# EasyEDA Pro project Zhurong_高低温功耗测试转接板.eprj

# Schematic Schematic1
Create Date: 2023-06-25; Page Name: P1; Project Name: Zhurong_高低温功耗测试转接板; Schematic Name: Schematic1; Update Date: 2023-06-26; Company: 嘉立创EDA; Page Size: A4; Version: V1.0
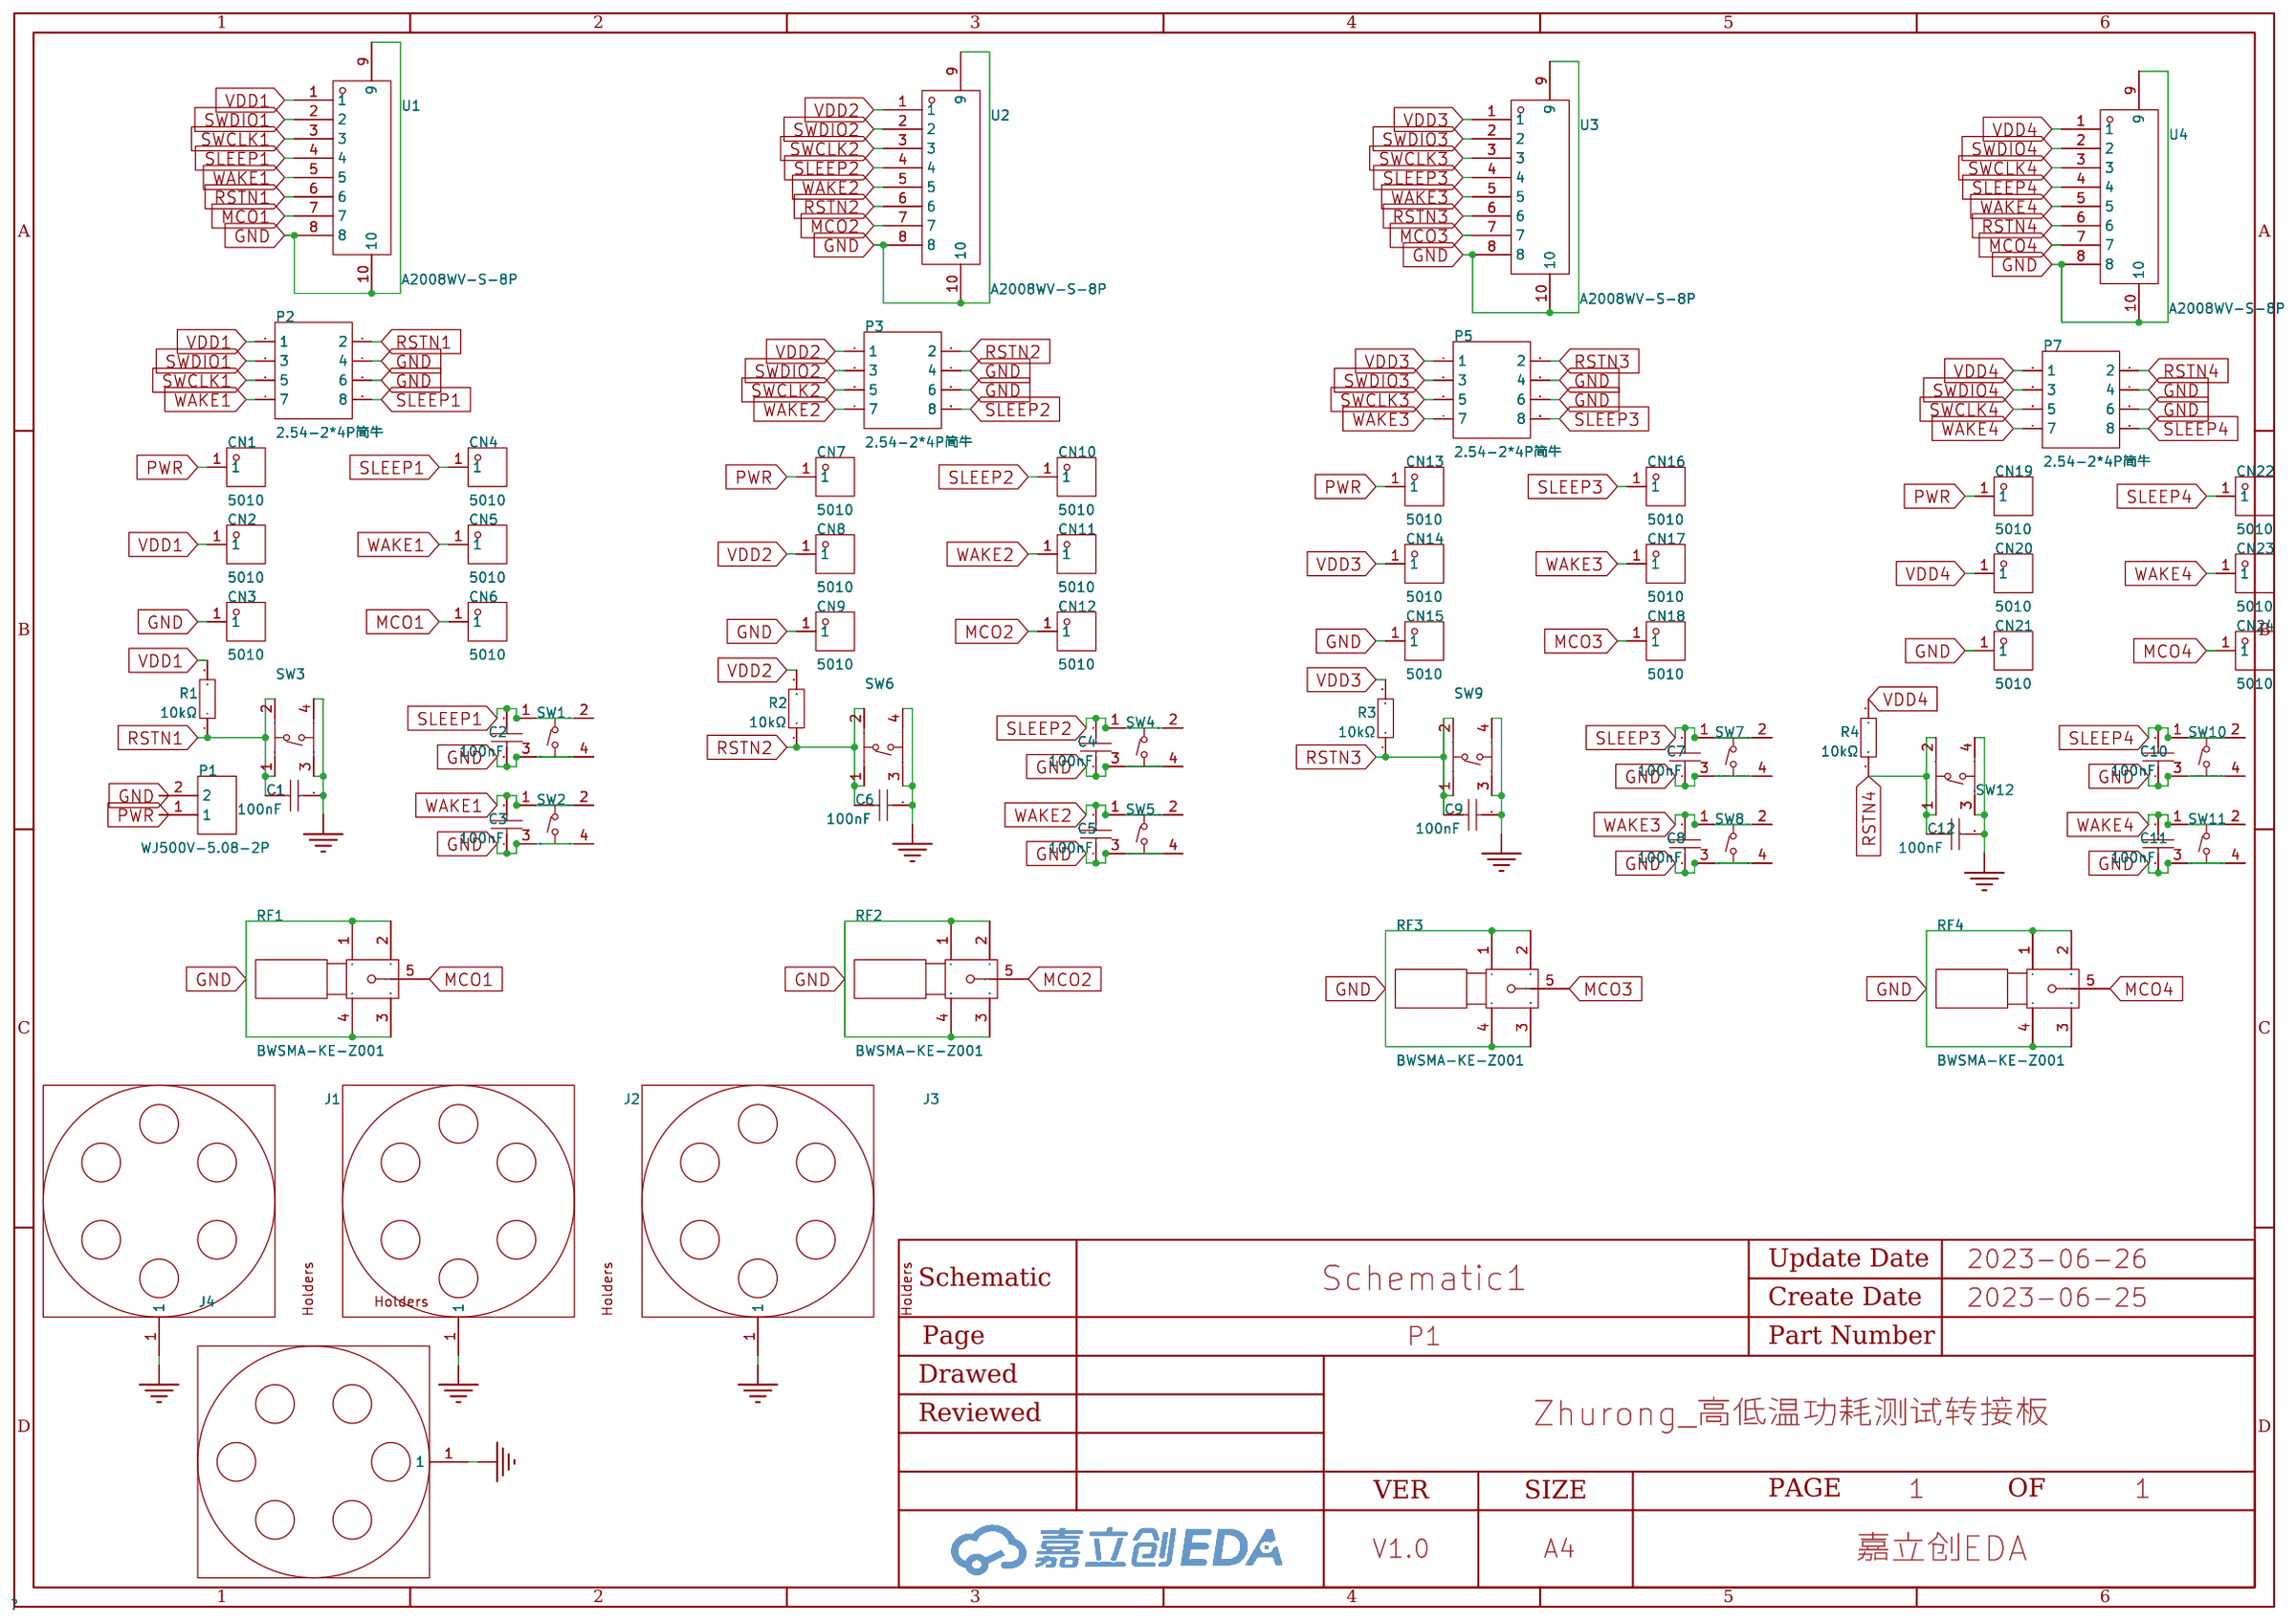
[diagram p0: schematic sheet]

## Parts
C1  100nF  [C0603]
C2  100nF  [C0603]
C3  100nF  [C0603]
C4  100nF  [C0603]
C5  100nF  [C0603]
C6  100nF  [C0603]
C7  100nF  [C0603]
C8  100nF  [C0603]
C9  100nF  [C0603]
C10  100nF  [C0603]
C11  100nF  [C0603]
C12  100nF  [C0603]
CN1  5010  [TESTPOINT-TH_BD3.2]
CN2  5010  [TESTPOINT-TH_BD3.2]
CN3  5010  [TESTPOINT-TH_BD3.2]
CN4  5010  [TESTPOINT-TH_BD3.2]
CN5  5010  [TESTPOINT-TH_BD3.2]
CN6  5010  [TESTPOINT-TH_BD3.2]
CN7  5010  [TESTPOINT-TH_BD3.2]
CN8  5010  [TESTPOINT-TH_BD3.2]
CN9  5010  [TESTPOINT-TH_BD3.2]
CN10  5010  [TESTPOINT-TH_BD3.2]
CN11  5010  [TESTPOINT-TH_BD3.2]
CN12  5010  [TESTPOINT-TH_BD3.2]
CN13  5010  [TESTPOINT-TH_BD3.2]
CN14  5010  [TESTPOINT-TH_BD3.2]
CN15  5010  [TESTPOINT-TH_BD3.2]
CN16  5010  [TESTPOINT-TH_BD3.2]
CN17  5010  [TESTPOINT-TH_BD3.2]
CN18  5010  [TESTPOINT-TH_BD3.2]
CN19  5010  [TESTPOINT-TH_BD3.2]
CN20  5010  [TESTPOINT-TH_BD3.2]
CN21  5010  [TESTPOINT-TH_BD3.2]
CN22  5010  [TESTPOINT-TH_BD3.2]
CN23  5010  [TESTPOINT-TH_BD3.2]
CN24  5010  [TESTPOINT-TH_BD3.2]
J1  -  [DEMO板安装孔]
J2  -  [DEMO板安装孔]
J3  -  [DEMO板安装孔]
J4  -  [DEMO板安装孔]
P1  WJ500V-5.08-2P  [CONN-TH_2P-P5.00_WJ500V-5.08-2P]
P2  2.54-2*4P简牛  [IDC-TH_8P-P2.54-V-R2-C4-S2.54]
P3  2.54-2*4P简牛  [IDC-TH_8P-P2.54-V-R2-C4-S2.54]
P5  2.54-2*4P简牛  [IDC-TH_8P-P2.54-V-R2-C4-S2.54]
P7  2.54-2*4P简牛  [IDC-TH_8P-P2.54-V-R2-C4-S2.54]
R1  10kΩ  [R0805]
R2  10kΩ  [R0805]
R3  10kΩ  [R0805]
R4  10kΩ  [R0805]
RF1  BWSMA-KE-Z001  [SMA-TH_BWSMA-KE-Z001]
RF2  BWSMA-KE-Z001  [SMA-TH_BWSMA-KE-Z001]
RF3  BWSMA-KE-Z001  [SMA-TH_BWSMA-KE-Z001]
RF4  BWSMA-KE-Z001  [SMA-TH_BWSMA-KE-Z001]
SW1  YTS-C015-2K  [SW-SMD_4P-L4.5-W4.5-P3.00-LS6.8]
SW2  YTS-C015-2K  [SW-SMD_4P-L4.5-W4.5-P3.00-LS6.8]
SW3  YTS-C015-2K  [SW-SMD_4P-L4.5-W4.5-P3.00-LS6.8]
SW4  YTS-C015-2K  [SW-SMD_4P-L4.5-W4.5-P3.00-LS6.8]
SW5  YTS-C015-2K  [SW-SMD_4P-L4.5-W4.5-P3.00-LS6.8]
SW6  YTS-C015-2K  [SW-SMD_4P-L4.5-W4.5-P3.00-LS6.8]
SW7  YTS-C015-2K  [SW-SMD_4P-L4.5-W4.5-P3.00-LS6.8]
SW8  YTS-C015-2K  [SW-SMD_4P-L4.5-W4.5-P3.00-LS6.8]
SW9  YTS-C015-2K  [SW-SMD_4P-L4.5-W4.5-P3.00-LS6.8]
SW10  YTS-C015-2K  [SW-SMD_4P-L4.5-W4.5-P3.00-LS6.8]
SW11  YTS-C015-2K  [SW-SMD_4P-L4.5-W4.5-P3.00-LS6.8]
SW12  YTS-C015-2K  [SW-SMD_4P-L4.5-W4.5-P3.00-LS6.8]
U1  A2008WV-S-8P  [CONN-SMD_A2008WV-S-8P]
U2  A2008WV-S-8P  [CONN-SMD_A2008WV-S-8P]
U3  A2008WV-S-8P  [CONN-SMD_A2008WV-S-8P]
U4  A2008WV-S-8P  [CONN-SMD_A2008WV-S-8P]

## Library data of the parts
C1-C12 = 0603B104K500NT: 容值:100nF;精度:±10%;额定电压:50V;材质(温度系数):X7R;; LCSC Part Name: 100nF ±10% 50V; Supplier Part: C30926; Manufacturer: FH(风华); Supplier Footprint: 0603; JLCPCB Part Class: Extended Part; Datasheet: https://atta.szlcsc.com/upload/public/pdf/source/20170923/C30926_1506149436298988724.pdf; Supplier: LCSC; Tolerance: ±10%; Voltage Rated: 50V; Temperature Coefficient: X7R
CN1-CN24 = 5010_C2906765: LCSC Part Name: 测试点; Supplier Part: C2906765; Manufacturer: Keystone; JLCPCB Part Class: Extended Part; Datasheet: https://atta.szlcsc.com/upload/public/pdf/source/20211102/FE81CF4D2CA40A78538BB94A7617104F.pdf; Supplier: LCSC
J1-J4 = 螺孔_3.1X6MM
P1 = WJ500V-5.08-2P: 间距:5.08mm;结构:1x2P;排数:1;每排PIN数:2;安装方式:直针;额定电流:18A;额定电压:250V;线规 - AWG:14~30;线规 - mm2:2.5;工作温度范围:-40℃~+105℃;颜色:绿色;; LCSC Part Name: 5.08mm 1x2P 排数:1 每排P数:2 直针 可拼接; Supplier Part: C8465; Manufacturer: KANGNEX(康奈克斯电气); Supplier Footprint: 插件,P=5.08mm; JLCPCB Part Class: Extended Part; Datasheet: https://atta.szlcsc.com/upload/public/pdf/source/20191225/C8465_02D34CE5B5B4A53DF5891601D97FA9F4.pdf; Supplier: LCSC; Pitch: 5.08mm; Structure: 1x2P; Number of Rows: 1; Number of PINs Per Row: 2; Mounting Style: 直针; Current Rating (Max): 18A; Voltage Rating (Max): 250V; Wire Gauge - AWG: 14~30; Wire Gauge - mm2: 2.5; Operating Temperature Range: -40℃~+105℃; Color: 绿色
P2 P3 P5 P7 = 2.54-2*4P简牛: 连接器类型:简牛座;每排PIN数:4;结构:2x4P;排数:2;间距:2.54mm;行距:2.54mm;封装形式:直插;触头材质:-;触头镀层:-;; LCSC Part Name: 每排P数:4 2x4P 排数:2 2.54mm; Supplier Part: C9135; Manufacturer: BOOMELE(博穆精密); Supplier Footprint: 插件,P=2.54mm; JLCPCB Part Class: Extended Part; Datasheet: https://atta.szlcsc.com/upload/public/pdf/source/20131122/1457706661290.pdf; Supplier: LCSC; Connector Type: 简牛座; Pin Number in each Row: 4; Structure: 2x4P; Number of Rows: 2; Pitch: 2.54mm; Row Spacing: 2.54mm; Holder Type: 直插
R1-R4 = RC0805FR-0710KL: 阻值:10kΩ;精度:±1%;功率:125mW;温度系数:±100ppm/℃;最大工作电压:150V;工作温度范围:-55℃~+155℃;; LCSC Part Name: 10kΩ ±1% 125mW; Supplier Part: C84376; Manufacturer: YAGEO(国巨); Supplier Footprint: 0805; JLCPCB Part Class: Extended Part; Datasheet: https://atta.szlcsc.com/upload/public/pdf/source/20170412/1491969112878.pdf; Supplier: LCSC; Tolerance: ±1%; Power(Watts): 125mW; Temperature Coefficient: ±100ppm/℃; Overload Voltage (Max): 150V; Operating Temperature Range: -55℃~+155℃
RF1-RF4 = BWSMA-KE-Z001_C496549: 连接器类型:板端;射频系列:SMA;接口类型:内孔;端口数量:1;阻抗:50Ω;频率-最大值:12.4GHz;样式:正脚;接口直径:-;接口长度/高度:-;工作温度范围:-65℃~+165℃;; LCSC Part Name: SMA 内孔 正脚 SMA直头正脚板端座子; Supplier Part: C496549; Manufacturer: BAT WIRELESS(蝙蝠无线); Supplier Footprint: 插件; JLCPCB Part Class: Extended Part; Datasheet: https://atta.szlcsc.com/upload/public/pdf/source/20200416/C496549_767995352B6C9E98F20D658FDC70347F.pdf; Supplier: LCSC; Connector Type: 板端; RF Series: SMA; Interface Type: 内孔; Number of Ports: 1; Impedance: 50Ω; Frequency-Max: 12.4GHz; Style: 正脚; Operating Temperature Range: -65℃~+165℃
SW1-SW12 = YTS-C015-2K: 触点电流:50mA;额定电压(DC):12V;绝缘电阻:100MΩ;电路结构:单刀单掷;安装方式:立贴;作用力:260gf@±50gf;机械寿命:5万次;带支架:否;; LCSC Part Name: 4.5*4.5*9mm 立贴 轻触开关; Supplier Part: C2910853; Manufacturer: YIYUAN(怡远); Supplier Footprint: SMD; JLCPCB Part Class: Extended Part; Datasheet: https://atta.szlcsc.com/upload/public/pdf/source/20211108/F9693C0D937C44F164226CF82C756AB9.pdf; Supplier: LCSC; Contact Current: 50mA; Voltage Rating (DC): 12V; Insulation Resistance: 100MΩ; Circuit: 单刀单掷; Mounting Style: 立贴; Actuator Style: 圆形按钮; Actuator/Cap Color: 黑色; Operating Force: 260gf@±50gf; Mechanical Life: 5万次; Pin Style: 鸥翼型; Switch Length: 4.5mm; Switch Width: 4.5mm; Switch Height: 9mm; Strike Gundam: 否
U1-U4 = A2008WV-S-8P: 参考系列:PH;间距:2mm;插针结构:1x8P;排数:1;每排PIN数:8;行距:-;安装方式:-;触头材质:黄铜;; LCSC Part Name: PH 2mm 1x8P 镀锡; Supplier Part: C273128; Manufacturer: CJT(长江连接器); Supplier Footprint: SMD,P=2mm; JLCPCB Part Class: Extended Part; Datasheet: https://atta.szlcsc.com/upload/public/pdf/source/20180913/C273128_BB1852F7672CD820F7AD4E26555E7BEC.pdf; Supplier: LCSC; Reference Series: PH; Pitch: 2mm; Pins Structure: 1x8P; Number of Rows: 1; Number of PINs Per Row: 8; Contact Material: 黄铜

## Nets
GND: C1.2 C2.1 C3.1 C4.1 C5.1 C6.2 C7.1 C8.1 C9.2 C10.1 C11.1 C12.2 CN3.1 CN9.1 CN15.1 CN21.1 J1.1 J2.1 J3.1 J4.1 P1.2 P2.4 P2.6 P3.4 P3.6 P5.4 P5.6 P7.4 P7.6 RF1.1 RF1.2 RF1.3 RF1.4 RF2.1 RF2.2 RF2.3 RF2.4 RF3.1 RF3.2 RF3.3 RF3.4 RF4.1 RF4.2 RF4.3 RF4.4 SW1.3 SW1.4 SW2.3 SW2.4 SW3.3 SW3.4 SW4.3 SW4.4 SW5.3 SW5.4 SW6.3 SW6.4 SW7.3 SW7.4 SW8.3 SW8.4 SW9.3 SW9.4 SW10.3 SW10.4 SW11.3 SW11.4 SW12.3 SW12.4 U1.8 U1.9 U1.10 U2.8 U2.9 U2.10 U3.8 U3.9 U3.10 U4.8 U4.9 U4.10
VDD1: CN2.1 P2.1 R1.2 U1.1
VDD2: CN8.1 P3.1 R2.2 U2.1
VDD3: CN14.1 P5.1 R3.2 U3.1
VDD4: CN20.1 P7.1 R4.2 U4.1
MCO1: CN6.1 RF1.5 U1.7
MCO2: CN12.1 RF2.5 U2.7
MCO3: CN18.1 RF3.5 U3.7
MCO4: CN24.1 RF4.5 U4.7
PWR: CN1.1 CN7.1 CN13.1 CN19.1 P1.1
RSTN1: C1.1 P2.2 R1.1 SW3.1 SW3.2 U1.6
RSTN2: C6.1 P3.2 R2.1 SW6.1 SW6.2 U2.6
RSTN3: C9.1 P5.2 R3.1 SW9.1 SW9.2 U3.6
RSTN4: C12.1 P7.2 R4.1 SW12.1 SW12.2 U4.6
SLEEP1: C2.2 CN4.1 P2.8 SW1.1 SW1.2 U1.4
SLEEP2: C4.2 CN10.1 P3.8 SW4.1 SW4.2 U2.4
SLEEP3: C7.2 CN16.1 P5.8 SW7.1 SW7.2 U3.4
SLEEP4: C10.2 CN22.1 P7.8 SW10.1 SW10.2 U4.4
SWCLK1: P2.5 U1.3
SWCLK2: P3.5 U2.3
SWCLK3: P5.5 U3.3
SWCLK4: P7.5 U4.3
SWDIO1: P2.3 U1.2
SWDIO2: P3.3 U2.2
SWDIO3: P5.3 U3.2
SWDIO4: P7.3 U4.2
WAKE1: C3.2 CN5.1 P2.7 SW2.1 SW2.2 U1.5
WAKE2: C5.2 CN11.1 P3.7 SW5.1 SW5.2 U2.5
WAKE3: C8.2 CN17.1 P5.7 SW8.1 SW8.2 U3.5
WAKE4: C11.2 CN23.1 P7.7 SW11.1 SW11.2 U4.5

# Board PCB1
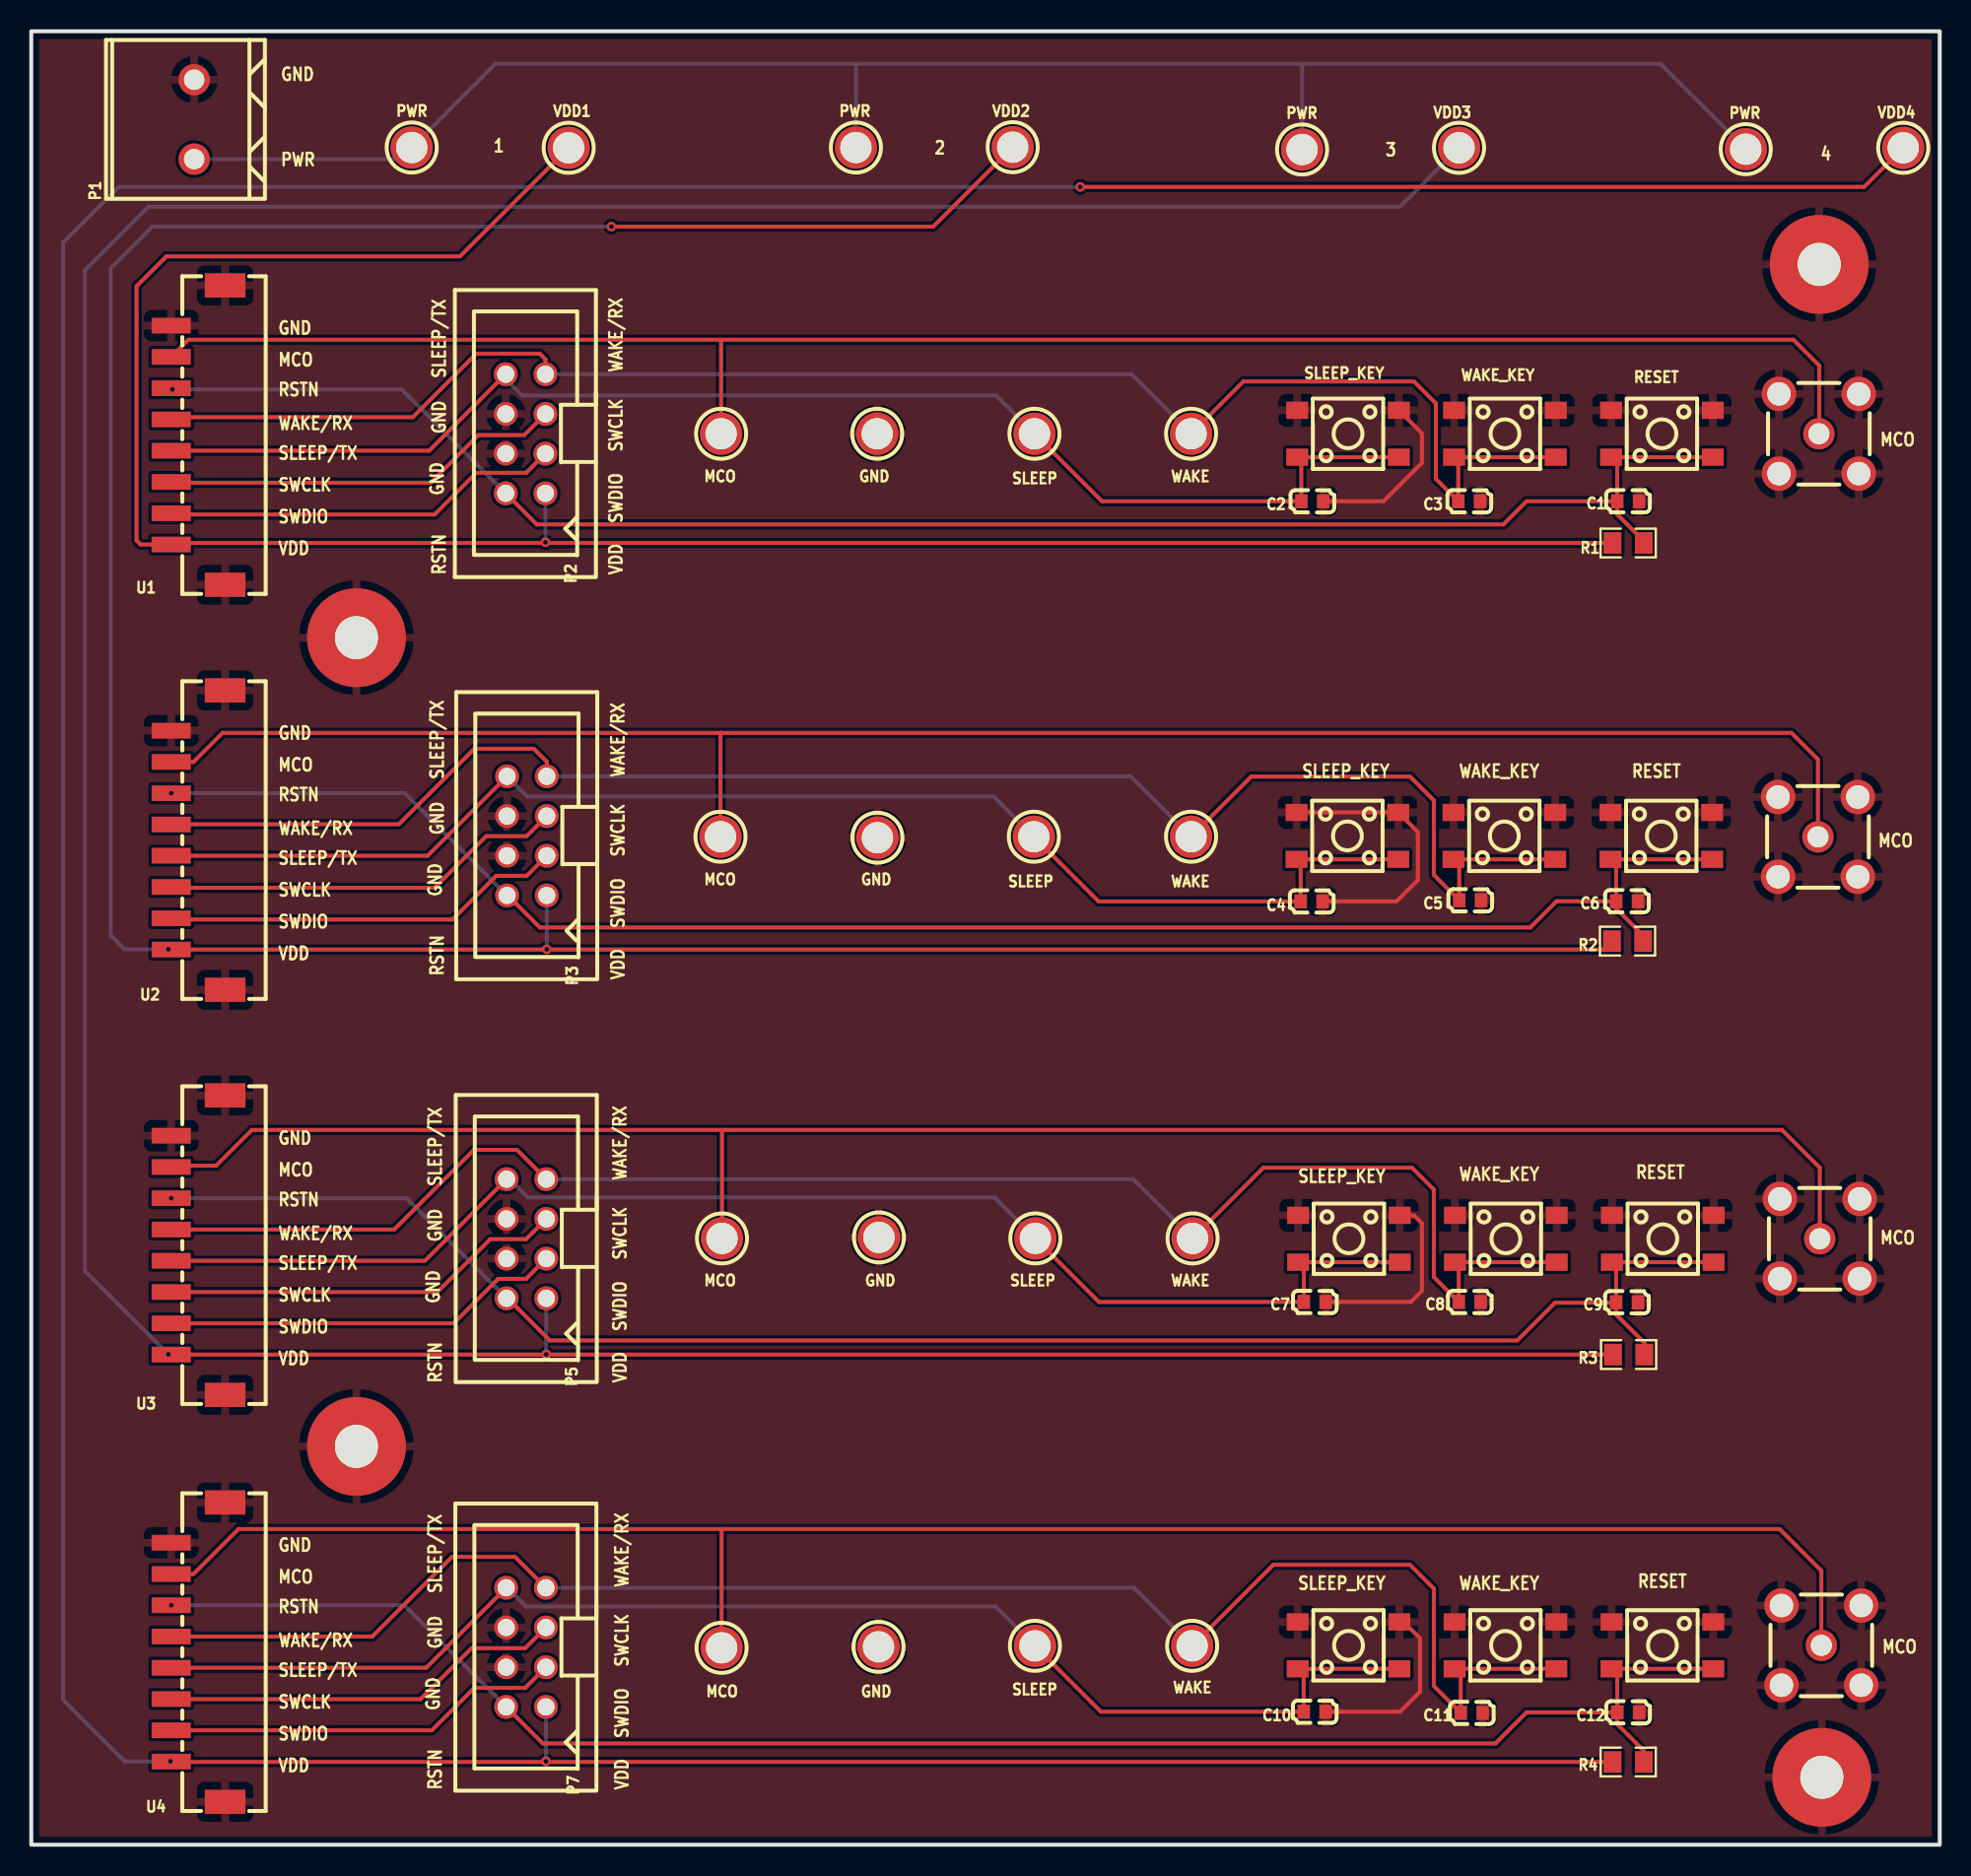
[diagram p1: board, top side]
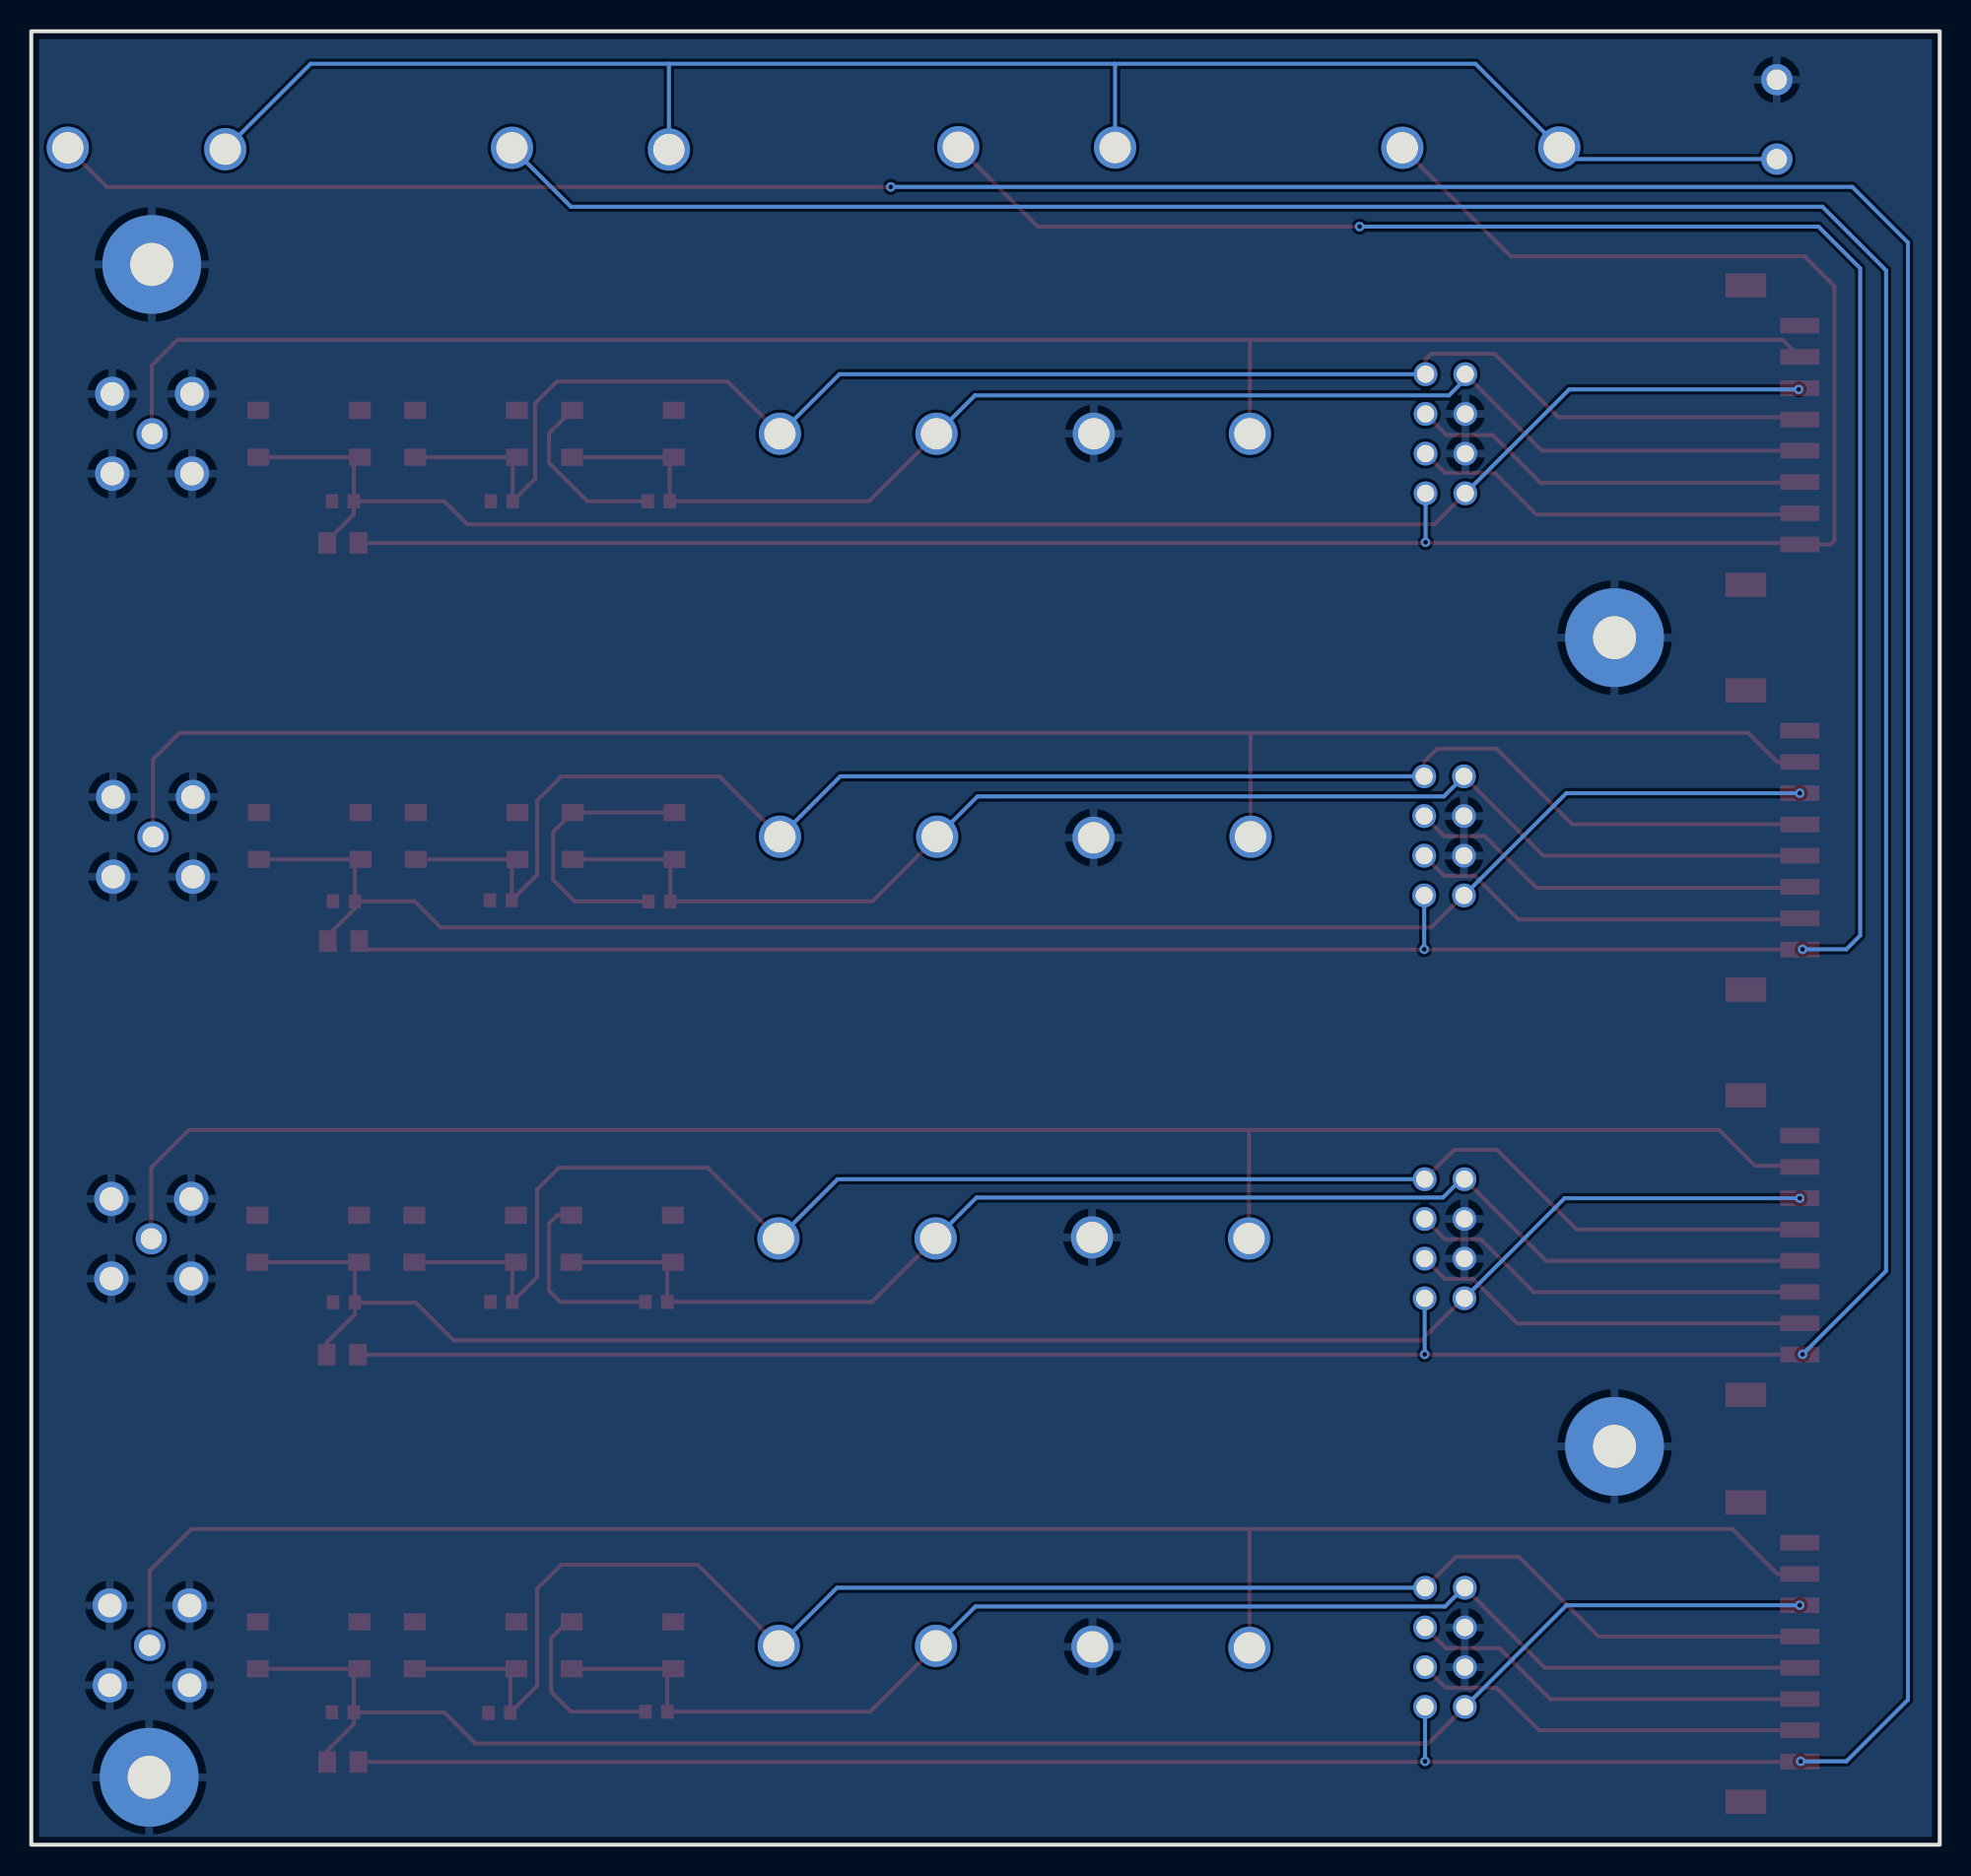
[diagram p2: board, bottom side, seen from below]

Outline 122 x 116 mm; copper layers: Top Layer, Bottom Layer. Coordinates in mm from the lower left corner of the outline.
Outline path: rectangle 0,116 122,0
Stack: Top Layer 0.035mm / Dielectric1 1.51mm FR4 er 4.5 / Bottom Layer 0.035mm

## Design rules (mm)
template: 自定义配置
spacing copperThickness1oz (default): track to track 0.102, other pairs 0.152 to 0.3
spacing copperThickness2oz: track to track 0.203, other pairs 0.152 to 0.3
track width copperThickness1oz (default): min 0.127, default 0.254, max 2.54
track width copperThickness2oz: min 0.203, default 0.254, max 2.54
differential pair differentialPair (default): width min 0.127, default 0.254, max 2.54; gap min 0.152, default 0.152
via viaSize (default): diameter min 0.5, default 0.61, max 10; hole min 0.3, default 0.305, max 6.3

## Placement (name value [footprint] x y rotation side)
C1  100nF  [C0603]  102.08 85.94 0 top
C2  100nF  [C0603]  81.89 85.94 180 top
C3  100nF  [C0603]  91.92 85.94 180 top
C4  100nF  [C0603]  81.85 60.34 180 top
C5  100nF  [C0603]  91.98 60.41 180 top
C6  100nF  [C0603]  102.02 60.35 0 top
C7  100nF  [C0603]  82.05 34.72 180 top
C8  100nF  [C0603]  91.95 34.72 180 top
C9  100nF  [C0603]  102.01 34.7 0 top
C10  100nF  [C0603]  82.04 8.51 180 top
C11  100nF  [C0603]  92.08 8.44 180 top
C12  100nF  [C0603]  102.09 8.47 0 top
GND  -  [TESTPOINT-TH_BD3.2]  54.08 90.25 90 top
GND#2  -  [TESTPOINT-TH_BD3.2]  54.09 64.42 90 top
GND#3  -  [TESTPOINT-TH_BD3.2]  54.19 38.85 90 top
GND#4  -  [TESTPOINT-TH_BD3.2]  54.16 12.66 90 top
J1  -  [demo板安装孔]  20.79 77.21 0 top
J2  -  [demo板安装孔]  114.3 101.09 0 top
J3  -  [demo板安装孔]  114.46 4.31 0 top
J4  -  [demo板安装孔]  20.79 25.48 0 top
MCO  -  [TESTPOINT-TH_BD3.2]  44.1 90.25 90 top
MCO#2  -  [TESTPOINT-TH_BD3.2]  44.06 64.48 90 top
MCO#3  -  [TESTPOINT-TH_BD3.2]  44.16 38.78 90 top
MCO#4  -  [TESTPOINT-TH_BD3.2]  44.13 12.6 90 top
P1  WJ500V-5.08-2P  [CONN-TH_2P-P5.00_WJ500V-5.08-2P]  10.41 110.36 90 top
P2  2.54-2*4P简牛  [IDC-TH_8P-P2.54-V-R2-C4-S2.54]  31.6 90.25 90 top
P3  2.54-2*4P简牛  [IDC-TH_8P-P2.54-V-R2-C4-S2.54]  31.68 64.53 90 top
P5  2.54-2*4P简牛  [IDC-TH_8P-P2.54-V-R2-C4-S2.54]  31.65 38.76 90 top
P7  2.54-2*4P简牛  [IDC-TH_8P-P2.54-V-R2-C4-S2.54]  31.63 12.63 90 top
PWR  -  [TESTPOINT-TH_BD3.2]  24.32 108.56 0 top
PWR#2  -  [TESTPOINT-TH_BD3.2]  52.72 108.56 0 top
PWR#3  -  [TESTPOINT-TH_BD3.2]  81.24 108.44 0 top
PWR#4  -  [TESTPOINT-TH_BD3.2]  109.6 108.46 0 top
R1  10kΩ  [R0805]  102.08 83.27 180 top
R2  10kΩ  [R0805]  102.04 57.8 180 top
R3  10kΩ  [R0805]  102.11 31.35 180 top
R4  10kΩ  [R0805]  102.09 5.29 180 top
RESET  YTS-C015-2K  [SW-SMD_4P-L4.5-W4.5-P3.00-LS6.8]  104.24 90.25 180 top
RF1  BWSMA-KE-Z001  [SMA-TH_BWSMA-KE-Z001]  114.27 90.25 90 top
RF2  BWSMA-KE-Z001  [SMA-TH_BWSMA-KE-Z001]  114.22 64.47 90 top
RF3  BWSMA-KE-Z001  [SMA-TH_BWSMA-KE-Z001]  114.33 38.76 90 top
RF4  BWSMA-KE-Z001  [SMA-TH_BWSMA-KE-Z001]  114.43 12.75 90 top
SLEEP  -  [TESTPOINT-TH_BD3.2]  64.13 90.25 90 top
SLEEP#2  -  [TESTPOINT-TH_BD3.2]  64.09 64.48 90 top
SLEEP#3  -  [TESTPOINT-TH_BD3.2]  64.19 38.78 90 top
SLEEP#4  -  [TESTPOINT-TH_BD3.2]  64.16 12.72 90 top
SLEEP_KEY  YTS-C015-2K  [SW-SMD_4P-L4.5-W4.5-P3.00-LS6.8]  84.18 90.25 180 top
SW4  YTS-C015-2K  [SW-SMD_4P-L4.5-W4.5-P3.00-LS6.8]  84.13 64.53 180 top
SW5  YTS-C015-2K  [SW-SMD_4P-L4.5-W4.5-P3.00-LS6.8]  94.17 64.53 180 top
SW6  YTS-C015-2K  [SW-SMD_4P-L4.5-W4.5-P3.00-LS6.8]  104.2 64.53 180 top
SW7  YTS-C015-2K  [SW-SMD_4P-L4.5-W4.5-P3.00-LS6.8]  84.23 38.76 180 top
SW8  YTS-C015-2K  [SW-SMD_4P-L4.5-W4.5-P3.00-LS6.8]  94.27 38.76 180 top
SW9  YTS-C015-2K  [SW-SMD_4P-L4.5-W4.5-P3.00-LS6.8]  104.3 38.76 180 top
SW10  YTS-C015-2K  [SW-SMD_4P-L4.5-W4.5-P3.00-LS6.8]  84.21 12.75 180 top
SW11  YTS-C015-2K  [SW-SMD_4P-L4.5-W4.5-P3.00-LS6.8]  94.24 12.75 180 top
SW12  YTS-C015-2K  [SW-SMD_4P-L4.5-W4.5-P3.00-LS6.8]  104.27 12.75 180 top
U1  A2008WV-S-8P  [CONN-SMD_A2008WV-S-8P]  10.67 90.17 90 top
U2  A2008WV-S-8P  [CONN-SMD_A2008WV-S-8P]  10.67 64.26 90 top
U3  A2008WV-S-8P  [CONN-SMD_A2008WV-S-8P]  10.67 38.35 90 top
U4  A2008WV-S-8P  [CONN-SMD_A2008WV-S-8P]  10.67 12.32 90 top
VDD1  5010  [TESTPOINT-TH_BD3.2]  34.35 108.55 0 top
VDD2  5010  [TESTPOINT-TH_BD3.2]  62.74 108.59 0 top
VDD3  5010  [TESTPOINT-TH_BD3.2]  91.27 108.55 0 top
VDD4  5010  [TESTPOINT-TH_BD3.2]  119.67 108.55 0 top
WAKE  -  [TESTPOINT-TH_BD3.2]  74.14 90.25 90 top
WAKE#2  -  [TESTPOINT-TH_BD3.2]  74.14 64.48 90 top
WAKE#3  -  [TESTPOINT-TH_BD3.2]  74.24 38.78 90 top
WAKE#4  -  [TESTPOINT-TH_BD3.2]  74.21 12.72 90 top
WAKE_KEY  YTS-C015-2K  [SW-SMD_4P-L4.5-W4.5-P3.00-LS6.8]  94.21 90.25 180 top

## Footprints (pads in the part's own frame, mm; a bottom-side part is the same pattern mirrored in y, then rotated)
C0603
  rect 0.8x0.9 smd: 1(-0.7,0) 2(0.7,0)
CONN-SMD_A2008WV-S-8P
  rect 1x2.5 smd: 1(-7,1.724) 2(-5,1.724) 3(-3,1.724) 4(-1,1.724) 5(1,1.724) 6(2.999,1.724) 7(5,1.724) 8(7,1.724)
  rect 1.55x2.6 smd: 9(-9.575,-1.724) 10(9.575,-1.724)
CONN-TH_2P-P5.00_WJ500V-5.08-2P
  round 2 hole 1.3: 1(-2.54,0) 2(2.54,0)
demo板安装孔
  round 6.32 hole 2.75: 1(0,0)
IDC-TH_8P-P2.54-V-R2-C4-S2.54
  round 1.524 hole 1.1: 1(-3.81,-1.27) 2(-3.81,1.27) 3(-1.27,-1.27) 4(-1.27,1.27) 5(1.27,-1.27) 6(1.27,1.27) 7(3.81,-1.27) 8(3.81,1.27)
R0805
  rect 1.133x1.377 smd: 1(-1,0) 2(1,0)
SMA-TH_BWSMA-KE-Z001
  round 2.2 hole 1.5: 1(-2.55,-2.55) 2(-2.55,2.55) 3(2.55,2.55) 4(2.55,-2.55)
  round 2 hole 1.35: 5(0,0)
SW-SMD_4P-L4.5-W4.5-P3.00-LS6.8
  rect 1.4x1.1 smd: 1(-3.25,1.5) 2(3.25,1.5) 3(-3.25,-1.5) 4(3.25,-1.5)
TESTPOINT-TH_BD3.2
  round 2.7 hole 2: 1(0,0)

## Nets
GND: C1.2 C2.1 C3.1 C4.1 C5.1 C6.2 C7.1 C8.1 C9.2 C10.1 C11.1 C12.2 GND.1 GND#2.1 GND#3.1 GND#4.1 J1.1 J2.1 J3.1 J4.1 P1.2 P2.4 P2.6 P3.4 P3.6 P5.4 P5.6 P7.4 P7.6 RESET.3 RESET.4 RF1.1 RF1.2 RF1.3 RF1.4 RF2.1 RF2.2 RF2.3 RF2.4 RF3.1 RF3.2 RF3.3 RF3.4 RF4.1 RF4.2 RF4.3 RF4.4 SLEEP_KEY.3 SLEEP_KEY.4 SW4.3 SW4.4 SW5.3 SW5.4 SW6.3 SW6.4 SW7.3 SW7.4 SW8.3 SW8.4 SW9.3 SW9.4 SW10.3 SW10.4 SW11.3 SW11.4 SW12.3 SW12.4 U1.8 U1.9 U1.10 U2.8 U2.9 U2.10 U3.8 U3.9 U3.10 U4.8 U4.9 U4.10 WAKE_KEY.3 WAKE_KEY.4
VDD1: P2.1 R1.2 U1.1 VDD1.1
VDD2: P3.1 R2.2 U2.1 VDD2.1
VDD3: P5.1 R3.2 U3.1 VDD3.1
VDD4: P7.1 R4.2 U4.1 VDD4.1
MCO1: MCO.1 RF1.5 U1.7
MCO2: MCO#2.1 RF2.5 U2.7
MCO3: MCO#3.1 RF3.5 U3.7
MCO4: MCO#4.1 RF4.5 U4.7
PWR: P1.1 PWR.1 PWR#2.1 PWR#3.1 PWR#4.1
RSTN1: C1.1 P2.2 R1.1 RESET.1 RESET.2 U1.6
RSTN2: C6.1 P3.2 R2.1 SW6.1 SW6.2 U2.6
RSTN3: C9.1 P5.2 R3.1 SW9.1 SW9.2 U3.6
RSTN4: C12.1 P7.2 R4.1 SW12.1 SW12.2 U4.6
SLEEP1: C2.2 P2.8 SLEEP.1 SLEEP_KEY.1 SLEEP_KEY.2 U1.4
SLEEP2: C4.2 P3.8 SLEEP#2.1 SW4.1 SW4.2 U2.4
SLEEP3: C7.2 P5.8 SLEEP#3.1 SW7.1 SW7.2 U3.4
SLEEP4: C10.2 P7.8 SLEEP#4.1 SW10.1 SW10.2 U4.4
SWCLK1: P2.5 U1.3
SWCLK2: P3.5 U2.3
SWCLK3: P5.5 U3.3
SWCLK4: P7.5 U4.3
SWDIO1: P2.3 U1.2
SWDIO2: P3.3 U2.2
SWDIO3: P5.3 U3.2
SWDIO4: P7.3 U4.2
WAKE1: C3.2 P2.7 U1.5 WAKE.1 WAKE_KEY.1 WAKE_KEY.2
WAKE2: C5.2 P3.7 SW5.1 SW5.2 U2.5 WAKE#2.1
WAKE3: C8.2 P5.7 SW8.1 SW8.2 U3.5 WAKE#3.1
WAKE4: C11.2 P7.7 SW11.1 SW11.2 U4.5 WAKE#4.1

## Via types
v1: diameter 0.61, hole 0.305, Top Layer to Bottom Layer, 14 vias

## Routing (per net, layer and track width the routed paths; a pad name or vN(x,y) marks a point on that pad's centre or on a via; arc(x,y) is an arc through that point)
GND: length 53.4
  Top Layer w0.254: SLEEP_KEY.3 88.9,90.28 88.9,88.39 86.44,85.94 C2.1 ; SW4.4 SW4.3 88.65,64.77 88.65,61.72 87.26,60.34 C4.1 ; C10.1 87.5,8.51 88.77,9.78 88.77,13.21 87.73,14.25 SW10.3 ; SW7.3 88.39,40.26 88.9,39.75 88.9,35.43 88.19,34.72 C7.1
VDD1: length 145.4
  Top Layer w0.254: 32.87,83.27 32.87,83.27 v1(32.87,83.31) ; 32.87,83.27 9.04,83.27 U1.1 6.98,83.17 6.73,83.42 6.73,99.69 8.64,101.6 27.41,101.6 34.48,108.67 ; 32.87,83.27 R1.2
  Bottom Layer w0.254: P2.1 v1(32.87,83.31)
VDD2: length 203.6
  Top Layer w0.254: v1(32.95,57.28) 32.94,57.26 ; 32.94,57.26 100.5,57.26 R2.2 ; 32.94,57.26 U2.1 8.78,57.26 v1(8.76,57.28) ; v1(37.08,103.5) 57.66,103.5 VDD2.1
  Bottom Layer w0.254: P3.1 v1(32.95,57.28) ; v1(37.08,103.5) 7.75,103.5 5.08,100.84 5.08,58.17 5.97,57.28 v1(8.76,57.28)
VDD3: length 258.6
  Top Layer w0.254: U3.1 8.78,31.35 v1(8.76,31.37) ; 32.91,31.35 8.94,31.35 ; 32.91,31.35 32.92,31.37 v1(32.92,31.37) ; 32.91,31.35 R3.2
  Bottom Layer w0.254: 32.92,34.95 v1(32.92,31.37) ; v1(8.76,31.37) 3.43,36.7 3.43,100.71 7.5,104.78 87.5,104.78 VDD3.1
VDD4: length 317.6
  Top Layer w0.254: VDD4.1 117.17,106.05 v1(67.06,106.05) ; 32.92,5.29 32.9,5.32 v1(32.9,5.33) ; 32.92,5.29 8.97,5.29 U4.1 8.93,5.33 v1(8.89,5.33) ; 32.92,5.29 R4.2
  Bottom Layer w0.254: v1(8.89,5.33) 5.97,5.33 2.03,9.27 2.03,102.49 5.59,106.05 v1(67.06,106.05) ; P7.1 v1(32.9,5.33)
MCO1: length 116.9
  Top Layer w0.254: 44.06,96.27 10.04,96.27 U1.7 ; 44.06,96.27 44.1,96.23 MCO.1 ; 44.06,96.27 112.65,96.27 114.3,94.62 114.3,90.28 RF1.5
MCO2: length 118.3
  Top Layer w0.254: RF2.5 114.22,69.43 112.52,71.12 44.07,71.12 ; 44.07,71.12 44.06,71.11 MCO#2.1 ; 44.07,71.12 12.23,71.12 10.37,69.26 U2.7
MCO3: length 118.9
  Top Layer w0.254: U3.7 9.02,43.43 11.81,43.43 14.1,45.72 44.2,45.72 ; MCO#3.1 44.16,45.67 44.2,45.72 ; 44.2,45.72 111.92,45.72 114.33,43.31 RF3.5
MCO4: length 120.2
  Top Layer w0.254: U4.7 10.37,17.32 13.25,20.19 44.19,20.19 ; 44.19,20.19 111.77,20.19 114.43,17.53 RF4.5 ; 44.19,20.19 44.13,20.13 MCO#4.1
PWR: length 114.8
  Bottom Layer w0.254: 81.27,113.92 81.24,113.89 PWR#3.1 ; 81.27,113.92 52.76,113.92 ; 81.27,113.92 104.14,113.92 v1(109.6,108.46) ; 52.76,113.92 52.72,113.87 PWR#2.1 ; 52.76,113.92 29.68,113.92 PWR.1 23.58,107.82 P1.1
RSTN1: length 109.4
  Top Layer w0.254: R1.1 103.08,83.4 101.38,85.1 C1.1 ; C1.1 95.59,85.94 94.11,84.45 32.32,84.45 P2.2 ; C1.1 101.38,88.36 101.11,88.63 ; v1(9.02,93.09) 8.94,93.16 U1.6 ; 101.11,88.63 101.24,88.75 RESET.1 ; 101.11,88.63 RESET.2
  Bottom Layer w0.254: v1(9.02,93.09) 23.68,93.09 P2.2
RSTN2: length 109.2
  Top Layer w0.254: P3.2 30.46,60.72 32.51,58.67 95.83,58.67 97.51,60.35 C6.1 ; SW6.1 SW6.2 101.32,62.67 C6.1 ; C6.1 101.32,59.89 103.04,58.16 R2.1
  Bottom Layer w0.254: P3.2 23.87,67.26 v1(8.94,67.26)
RSTN3: length 110.4
  Top Layer w0.254: R3.1 103.11,32.12 101.31,33.92 C9.1 ; C9.1 101.31,37 SW9.2 SW9.1 ; C9.1 101.28,34.67 97.41,34.67 95,32.26 33.15,32.26 30.45,34.95 P5.2
  Bottom Layer w0.254: v1(8.94,41.35) 23.98,41.35 P5.2
RSTN4: length 110.2
  Top Layer w0.254: C12.1 95.59,8.47 93.6,6.48 32.7,6.48 P7.2 ; C12.1 101.39,7.71 103.09,6.01 R4.1 ; C12.1 101.39,10.89 SW12.2 SW12.1
  Bottom Layer w0.254: v1(8.94,15.32) 23.86,15.32 P7.2
SLEEP1: length 87.3
  Top Layer w0.254: SLEEP.1 68.45,85.94 C2.2 81.19,88.49 SLEEP_KEY.2 SLEEP_KEY.1 ; U1.4 25.43,89.17 P2.8
  Bottom Layer w0.254: SLEEP.1 61.67,92.71 31.37,92.71 30.33,93.75 P2.8
SLEEP2: length 86.9
  Top Layer w0.254: P3.8 25.33,63.26 U2.4 ; SLEEP#2.1 68.23,60.34 C4.2 81.15,62.77 SW4.2 SW4.1
  Bottom Layer w0.254: P3.8 31.7,67.06 61.51,67.06 SLEEP#2.1
SLEEP3: length 86.9
  Top Layer w0.254: P5.8 25.17,37.35 U3.4 ; SW7.1 81.34,37.26 81.16,37.08 ; SLEEP#3.1 68.25,34.72 C7.2 81.35,36.9 81.16,37.08 ; 81.16,37.08 80.98,37.26
  Bottom Layer w0.254: P5.8 30.58,42.57 31.75,41.4 61.57,41.4 SLEEP#3.1
SLEEP4: length 87.1
  Top Layer w0.254: U4.4 25.24,11.32 P7.8 ; 81.1,11.11 81.25,11.25 SW10.1 ; 81.1,11.11 81.34,10.87 C10.2 68.38,8.51 SLEEP#4.1 ; 81.1,11.11 SW10.2
  Bottom Layer w0.254: SLEEP#4.1 61.64,15.24 31.62,15.24 30.43,16.44 P7.8
SWCLK1: length 25.8
  Top Layer w0.254: U1.3 8.99,87.12 25.53,87.12 28.58,90.17 31.51,90.17 P2.5
SWCLK2: length 25.9
  Top Layer w0.254: P3.5 31.67,64.52 29.08,64.52 25.78,61.21 8.99,61.21 U2.3
SWCLK3: length 25.9
  Top Layer w0.254: 32.92,40.03 31.63,38.73 29.34,38.73 25.96,35.35 U3.3
SWCLK4: length 25.9
  Top Layer w0.254: P7.5 31.58,12.57 28.14,12.57 24.88,9.31 8.95,9.31 U4.3
SWDIO1: length 25.6
  Top Layer w0.254: U1.2 9.02,85.09 25.78,85.09 28.45,87.76 31.64,87.76 P2.3
SWDIO2: length 25.7
  Top Layer w0.254: P3.3 31.67,61.98 29.72,61.98 26.92,59.18 9.02,59.18 U2.2
SWDIO3: length 25.7
  Top Layer w0.254: U3.2 27,33.35 29.84,36.2 31.63,36.2 32.92,37.49
SWDIO4: length 25.6
  Top Layer w0.254: U4.2 25.61,7.32 28.32,10.03 31.58,10.03 P7.3
WAKE1: length 103.5
  Top Layer w0.254: U1.5 9.09,91.31 24.38,91.31 28.45,95.38 32.51,95.38 32.87,95.02 P2.7 ; WAKE.1 77.49,93.6 88.39,93.6 89.79,92.2 89.79,87.37 C3.2 91.22,88.49 WAKE_KEY.2 WAKE_KEY.1
  Bottom Layer w0.254: WAKE.1 70.33,94.06 P2.7
WAKE2: length 104.1
  Top Layer w0.254: 91.04,62.91 91.16,63.03 SW5.1 ; 91.04,62.91 91.28,62.67 C5.2 89.66,62.03 89.66,66.8 88.14,68.33 77.99,68.33 WAKE#2.1 ; 91.04,62.91 SW5.2 ; P3.7 32.95,69.28 32.13,70.1 28.32,70.1 23.5,65.28 8.96,65.28 U2.5
  Bottom Layer w0.254: P3.7 70.28,68.34 WAKE#2.1
WAKE3: length 104.5
  Top Layer w0.254: 91.14,37.14 SW8.2 ; 91.14,37.14 91.26,37.26 SW8.1 ; 91.14,37.14 91.25,37.03 C8.2 89.66,36.31 89.66,41.91 88.27,43.31 78.76,43.31 WAKE#3.1 ; 32.92,42.57 31.05,44.45 28.29,44.45 23.2,39.35 U3.5
  Bottom Layer w0.254: 32.92,42.57 70.45,42.57 WAKE#3.1
WAKE4: length 106.1
  Top Layer w0.254: WAKE#4.1 79.4,17.91 88.14,17.91 89.66,16.38 89.66,10.15 C11.2 91.38,10.86 SW11.2 SW11.1 ; P7.7 30.92,18.41 26.9,18.41 21.8,13.32 U4.5
  Bottom Layer w0.254: P7.7 70.5,16.44 WAKE#4.1

## Copper pours and planes (outline as drawn; the poured copper is in the pictures)
GND on Top Layer: 0,116 122,116 122,0 0,0
GND on Bottom Layer: 0,116 122,116 122,0 0,0

## Text on the board
Top Silkscreen Layer: 1 | 2 | 3 | 4 | SLEEP_KEY | WAKE_KEY | RESET | MCO | GND | RSTN | WAKE/RX | SLEEP/TX | SWCLK | SWDIO | VDD | PWR
